# Altium schematic sheet Temperature sensor - TC1046VNBTR.SchDoc
size A4; Organization: Altium Limited; Address1: 3 Minna Close; Address2: Belrose; Address3: NSW 2085; Address4: Australia
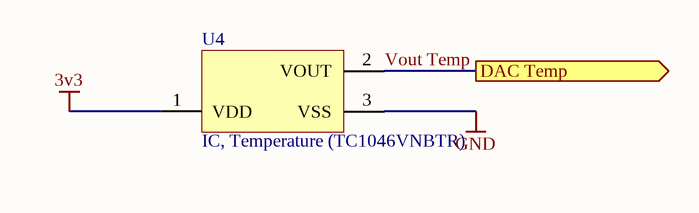
[diagram p0: Temperature sensor - TC1046VNBTR.SchDoc]

## Parts
U4  IC, Temperature (TC1046VNBTR)  [SOT-23-NB3_M]

## Ports
DAC Temp (out)

## Nets
3v3: U4.1(VDD)
GND: U4.3(VSS)
Vout Temp: U4.2(VOUT) ; port DAC Temp

## Notes on the sheet
- Title
- Size:
- Date:
- A4
- Name:
- Time:
- Ing. W. Pietersz
- Revision:
- Sheet
- of
- WillyPietersz@gmail.com
- Contact:
- info@unique-system.nl
- Unique System Elektronics
- Biesboschhaven noord 1-b
- 4251 NL Werkendam
- Netherlands
- www.unique-system.nl
- File:

## Library data of the parts
U4 = TC1046VNBTR: High Precision Temperature-to-Voltage Converter, 3-Pin SOT-23, Extended Temperature, Tape and Reel; FirstPublished: 29-Jan-2009; DatasheetVersion: revB, Feb-2003; PackageVersion: revBB, Aug-2009; PackageReference: SOT-23-NB3; Publisher: Altium Limited; PackageDescription: 3-Lead Plastic Small Outline Transistor (NB) [SOT-23]; Supplier 1: Digi-Key; Supplier Part Number 1: TC1046VNBTRTR-ND; Supplier 2: Digi-Key; Supplier Part Number 2: TC1046VNBTRCT-ND; Supplier 3: Digi-Key; Supplier Part Number 3: TC1046VNBTRDKR-ND; Supplier 4: Farnell; Supplier Part Number 4: 1212685; Supplier 5: Newark; Supplier Part Number 5: 89C8092; Code_IPC: SOT23-3; ComponentLink1Description: Datasheet; ComponentLink1URL: http://ww1.microchip.com/downloads/en/DeviceDoc/21496b.pdf; ComponentLink2Description: Packaging Specification; ComponentLink2URL: http://www.microchip.com/stellent/groups/techpub_sg/documents/packagingspec/en012702.pdf; ComponentLink3Description: Microchip.com Home; ComponentLink3URL: http://www.microchip.com/